# EAGLE schematic NixieBoard (EAGLE 9.6.2)
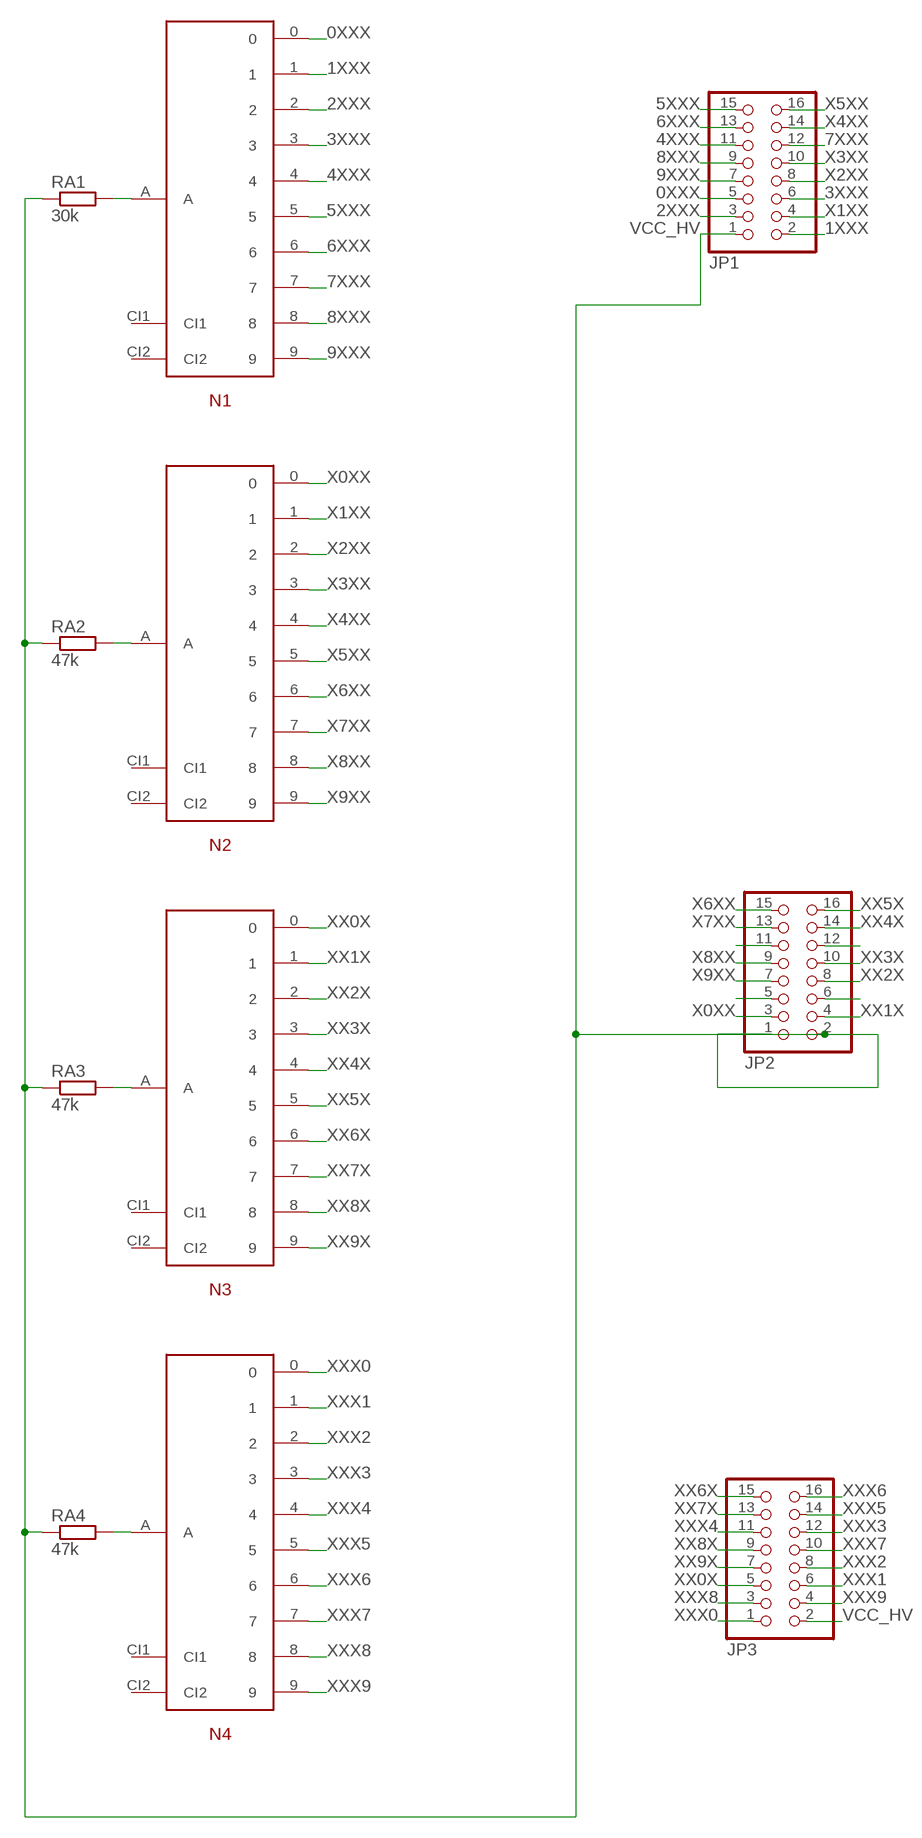
[diagram p0: schematic, sheet 1]

## Parts
JP1  PINHD-2X8  [2X08]
JP2  PINHD-2X8  [2X08]
JP3  PINHD-2X8  [2X08]
N1  F9057TUBE  [F9057PIN]
N2  F9057TUBE  [F9057PIN]
N3  F9057TUBE  [F9057PIN]
N4  F9057TUBE  [F9057PIN]
RA1  30k  R-EU_R2010  [R2010]
RA2  47k  R-EU_R2010  [R2010]
RA3  47k  R-EU_R2010  [R2010]
RA4  47k  R-EU_R2010  [R2010]

## Nets
0XXX: JP1.5 N1.0
1XXX: JP1.2 N1.1
2XXX: JP1.3 N1.2
3XXX: JP1.6 N1.3
4XXX: JP1.11 N1.4
5XXX: JP1.15 N1.5
6XXX: JP1.13 N1.6
7XXX: JP1.12 N1.7
8XXX: JP1.9 N1.8
9XXX: JP1.7 N1.9
N$3: JP2.5
N$6: JP2.11
N$11: JP2.12
N$14: JP2.6
N$35: N4.A RA4.2
N$36: N3.A RA3.2
N$37: N2.A RA2.2
N$38: N1.A RA1.2
VCC_HV: JP1.1 JP2.1 JP2.2 JP3.2 RA1.1 RA2.1 RA3.1 RA4.1
X0XX: JP2.3 N2.0
X1XX: JP1.4 N2.1
X2XX: JP1.8 N2.2
X3XX: JP1.10 N2.3
X4XX: JP1.14 N2.4
X5XX: JP1.16 N2.5
X6XX: JP2.15 N2.6
X7XX: JP2.13 N2.7
X8XX: JP2.9 N2.8
X9XX: JP2.7 N2.9
XX0X: JP3.5 N3.0
XX1X: JP2.4 N3.1
XX2X: JP2.8 N3.2
XX3X: JP2.10 N3.3
XX4X: JP2.14 N3.4
XX5X: JP2.16 N3.5
XX6X: JP3.15 N3.6
XX7X: JP3.13 N3.7
XX8X: JP3.9 N3.8
XX9X: JP3.7 N3.9
XXX0: JP3.1 N4.0
XXX1: JP3.6 N4.1
XXX2: JP3.8 N4.2
XXX3: JP3.12 N4.3
XXX4: JP3.11 N4.4
XXX5: JP3.14 N4.5
XXX6: JP3.16 N4.6
XXX7: JP3.10 N4.7
XXX8: JP3.3 N4.8
XXX9: JP3.4 N4.9
Unconnected: N1.CI1 N1.CI2 N2.CI1 N2.CI2 N3.CI1 N3.CI2 N4.CI1 N4.CI2

## Library data of the parts
JP1-JP3 = pinhead:PINHD-2X8: PIN HEADER
N1-N4 = F9057:F9057TUBE
RA1-RA4 = rcl:R-EU_: RESISTOR, European symbol; SPICEPREFIX: R